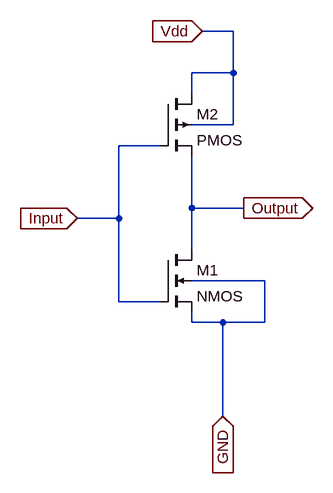
[diagram p0: schematic Not2.asc]
Not2.asc, the LTspice schematic file:
Version 4
SHEET 1 880 680
WIRE 16 -208 -32 -208
WIRE 16 -144 16 -208
WIRE 16 -144 -48 -144
WIRE -48 -112 -48 -144
WIRE 16 -64 16 -144
WIRE 16 -64 -48 -64
WIRE -96 -32 -160 -32
WIRE -48 64 -48 -16
WIRE 32 64 -48 64
WIRE -160 80 -160 -32
WIRE -160 80 -224 80
WIRE -48 128 -48 64
WIRE 64 176 -48 176
WIRE -160 208 -160 80
WIRE -96 208 -160 208
WIRE -48 240 -48 224
WIRE 0 240 -48 240
WIRE 64 240 64 176
WIRE 64 240 0 240
WIRE 0 384 0 240
FLAG 32 64 Output
IOPIN 32 64 Out
FLAG -224 80 Input
IOPIN -224 80 In
FLAG 0 384 GND
IOPIN 0 384 In
FLAG -32 -208 Vdd
IOPIN -32 -208 In
SYMBOL nmos4 -96 128 R0
SYMATTR InstName M1
SYMBOL pmos4 -96 -112 R0
SYMATTR InstName M2

The netlist it stands for:
* Not2.asc
M1 Output Input GND GND NMOS
M2 Vdd Input Output Vdd PMOS
.model NMOS NMOS
.model PMOS PMOS
.lib standard.mos
.backanno
.end